# Altium schematic sheet Nixie_top.SchDoc: Nixie top level
size A4; Author: L. Sartory; Organization: L. Sartory; Address2: Nixie clock; Address3: with GPS synchronization; DocumentNumber: 1; Revision: B1; SheetNumber: 1; SheetTotal: 12
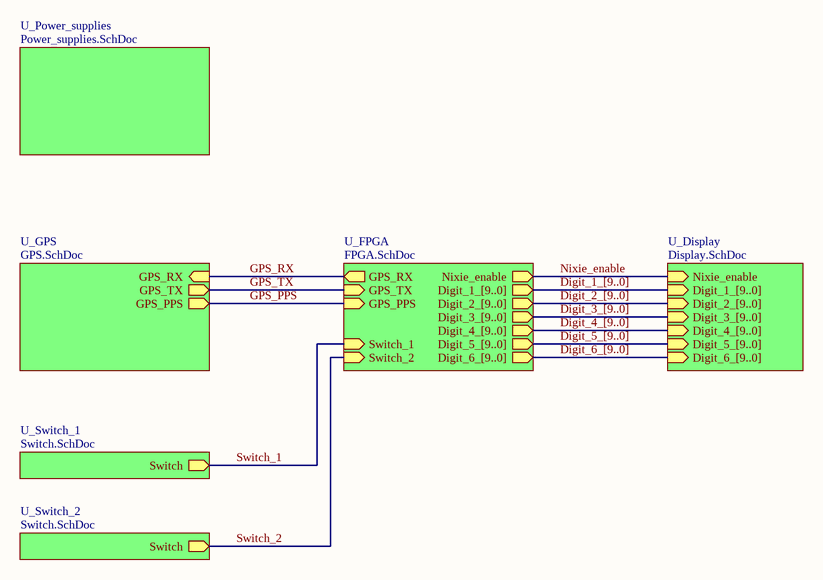
[diagram p0: Nixie_top.SchDoc]

## Sub-sheets
U_Display = Display.SchDoc: Nixie_enable (in), Digit_1_[9..0] (in), Digit_2_[9..0] (in), Digit_3_[9..0] (in), Digit_4_[9..0] (in), Digit_5_[9..0] (in), Digit_6_[9..0] (in)
U_FPGA = FPGA.SchDoc: Nixie_enable (out), Digit_1_[9..0] (out), Digit_2_[9..0] (out), Digit_3_[9..0] (out), Digit_4_[9..0] (out), Digit_5_[9..0] (out), Digit_6_[9..0] (out), GPS_RX (out), GPS_TX (in), GPS_PPS (in), Switch_2 (in), Switch_1 (in)
U_GPS = GPS.SchDoc: GPS_PPS (out), GPS_TX (out), GPS_RX (in)
U_Power_supplies = Power_supplies.SchDoc: no entries
U_Switch_1 = Switch.SchDoc: Switch (out)
U_Switch_2 = Switch.SchDoc: Switch (out)

## Nets
GPS_PPS: sheet U_FPGA/GPS_PPS, sheet U_GPS/GPS_PPS
GPS_RX: sheet U_FPGA/GPS_RX, sheet U_GPS/GPS_RX
GPS_TX: sheet U_FPGA/GPS_TX, sheet U_GPS/GPS_TX
Nixie_enable: sheet U_Display/Nixie_enable, sheet U_FPGA/Nixie_enable
Switch_1: sheet U_FPGA/Switch_1, sheet U_Switch_1/Switch
Switch_2: sheet U_FPGA/Switch_2, sheet U_Switch_2/Switch

## Buses and harness runs
bus Digit_1_[9..0] = sheet U_Display/Digit_1_[9..0] = sheet U_FPGA/Digit_1_[9..0]
bus Digit_2_[9..0] = sheet U_Display/Digit_2_[9..0] = sheet U_FPGA/Digit_2_[9..0]
bus Digit_3_[9..0] = sheet U_Display/Digit_3_[9..0] = sheet U_FPGA/Digit_3_[9..0]
bus Digit_4_[9..0] = sheet U_Display/Digit_4_[9..0] = sheet U_FPGA/Digit_4_[9..0]
bus Digit_5_[9..0] = sheet U_Display/Digit_5_[9..0] = sheet U_FPGA/Digit_5_[9..0]
bus Digit_6_[9..0] = sheet U_Display/Digit_6_[9..0] = sheet U_FPGA/Digit_6_[9..0]

## Notes on the sheet
- Title
- Size:
- Date:
- A4
- Number:
- Time:
- Revision:
- Sheet
- of
- File: